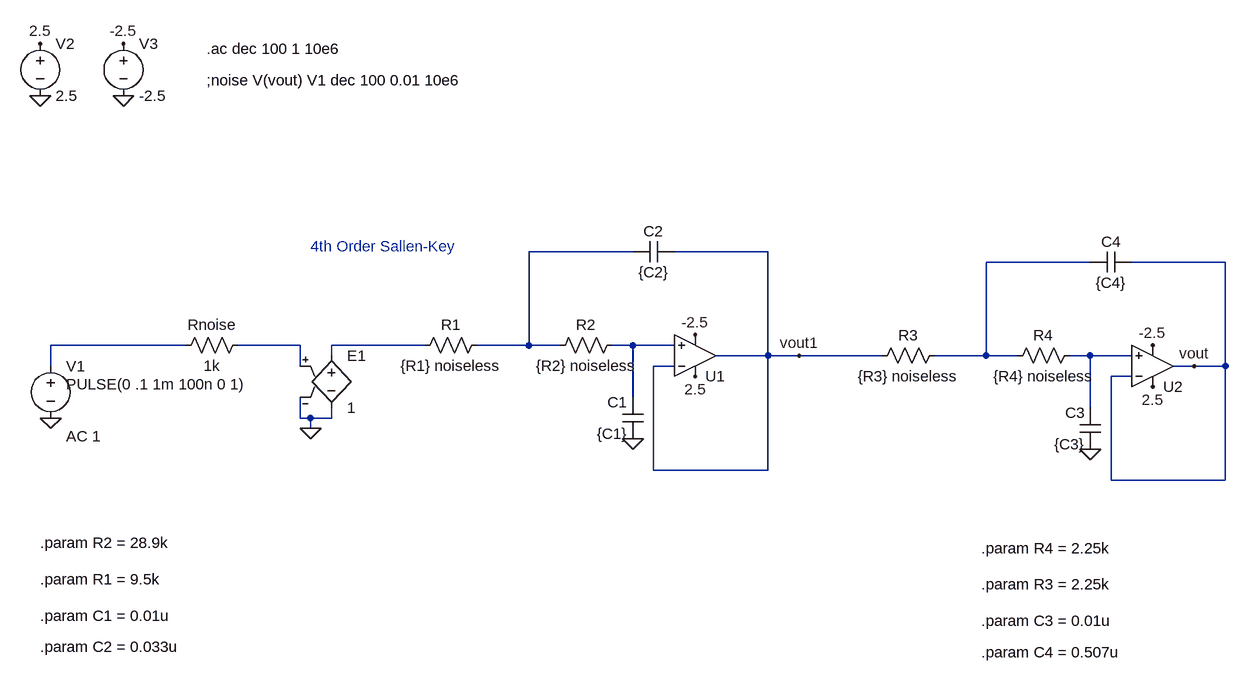
[diagram p0: schematic sallen_key_4th_order.asc]
sallen_key_4th_order.asc, the LTspice schematic file:
Version 4
SHEET 1 1916 856
WIRE 464 0 304 0
WIRE 672 0 528 0
WIRE 1168 16 1008 16
WIRE 1376 16 1232 16
WIRE -224 144 -432 144
WIRE -48 144 -144 144
WIRE 144 144 0 144
WIRE 304 144 304 0
WIRE 304 144 224 144
WIRE 352 144 304 144
WIRE 464 144 432 144
WIRE 528 144 464 144
WIRE 0 160 0 144
WIRE 672 160 672 0
WIRE 672 160 592 160
WIRE 720 160 672 160
WIRE 848 160 720 160
WIRE 1008 160 1008 16
WIRE 1008 160 928 160
WIRE 1056 160 1008 160
WIRE 1168 160 1136 160
WIRE 1232 160 1168 160
WIRE -432 176 -432 144
WIRE -48 176 -48 144
WIRE 528 176 496 176
WIRE 1328 176 1296 176
WIRE 1376 176 1376 16
WIRE 1376 176 1328 176
WIRE 1232 192 1200 192
WIRE 464 224 464 144
WIRE 1168 240 1168 160
WIRE -48 256 -48 224
WIRE -32 256 -48 256
WIRE 0 256 0 240
WIRE 0 256 -32 256
WIRE -32 272 -32 256
WIRE 496 336 496 176
WIRE 672 336 672 160
WIRE 672 336 496 336
WIRE 1200 352 1200 192
WIRE 1376 352 1376 176
WIRE 1376 352 1200 352
FLAG 560 192 2.5
FLAG 560 128 -2.5
FLAG 464 288 0
FLAG -432 256 0
FLAG -448 -320 2.5
FLAG -320 -320 -2.5
FLAG -448 -240 0
FLAG -320 -240 0
FLAG -32 272 0
FLAG 1264 208 2.5
FLAG 1264 144 -2.5
FLAG 1168 304 0
FLAG 1328 176 vout
FLAG 720 160 vout1
SYMBOL Opamps\\UniversalOpamp2 560 160 M180
SYMATTR InstName U1
SYMATTR Value2 Avol=10Meg GBW=10Meg Slew=10Meg
SYMBOL res 448 128 R90
WINDOW 0 0 56 VBottom 2
WINDOW 3 32 56 VTop 2
SYMATTR InstName R2
SYMATTR Value {R2} noiseless
SYMBOL res 240 128 R90
WINDOW 0 0 56 VBottom 2
WINDOW 3 32 56 VTop 2
SYMATTR InstName R1
SYMATTR Value {R1} noiseless
SYMBOL cap 528 -16 R90
WINDOW 0 0 32 VBottom 2
WINDOW 3 32 32 VTop 2
SYMATTR InstName C2
SYMATTR Value {C2}
SYMBOL cap 480 288 R180
WINDOW 0 24 56 Left 2
WINDOW 3 24 8 Left 2
SYMATTR InstName C1
SYMATTR Value {C1}
SYMBOL voltage -432 160 R0
WINDOW 123 24 124 Left 2
WINDOW 39 0 0 Left 0
WINDOW 3 24 44 Left 2
SYMATTR Value2 AC 1
SYMATTR Value PULSE(0 .1 1m 100n 0 1)
SYMATTR InstName V1
SYMBOL voltage -448 -336 R0
WINDOW 123 0 0 Left 0
WINDOW 39 0 0 Left 0
SYMATTR InstName V2
SYMATTR Value 2.5
SYMBOL voltage -320 -336 R0
WINDOW 123 0 0 Left 0
WINDOW 39 0 0 Left 0
SYMATTR InstName V3
SYMATTR Value -2.5
SYMBOL e 0 144 R0
SYMATTR InstName E1
SYMATTR Value 1
SYMBOL res -128 128 R90
WINDOW 0 0 56 VBottom 2
WINDOW 3 32 56 VTop 2
SYMATTR InstName Rnoise
SYMATTR Value 1k
SYMBOL Opamps\\UniversalOpamp2 1264 176 M180
SYMATTR InstName U2
SYMATTR Value2 Avol=10Meg GBW=10Meg Slew=10Meg
SYMBOL res 1152 144 R90
WINDOW 0 0 56 VBottom 2
WINDOW 3 32 56 VTop 2
SYMATTR InstName R4
SYMATTR Value {R4} noiseless
SYMBOL res 944 144 R90
WINDOW 0 0 56 VBottom 2
WINDOW 3 32 56 VTop 2
SYMATTR InstName R3
SYMATTR Value {R3} noiseless
SYMBOL cap 1232 0 R90
WINDOW 0 0 32 VBottom 2
WINDOW 3 32 32 VTop 2
SYMATTR InstName C4
SYMATTR Value {C4}
SYMBOL cap 1184 304 R180
WINDOW 0 24 56 Left 2
WINDOW 3 24 8 Left 2
SYMATTR InstName C3
SYMATTR Value {C3}
TEXT -32 -8 Left 2 ;4th Order Sallen-Key
TEXT -192 -312 Left 2 !.ac dec 100 1 10e6
TEXT -448 448 Left 2 !.param R2 = 28.9k
TEXT -448 560 Left 2 !.param C1 = 0.01u
TEXT -448 608 Left 2 !.param C2 = 0.033u
TEXT -448 504 Left 2 !.param R1 = 9.5k
TEXT -192 -264 Left 2 !;noise V(vout) V1 dec 100 0.01 10e6
TEXT 1000 456 Left 2 !.param R4 = 2.25k
TEXT 1000 568 Left 2 !.param C3 = 0.01u
TEXT 1000 616 Left 2 !.param C4 = 0.507u
TEXT 1000 512 Left 2 !.param R3 = 2.25k

The netlist it stands for:
* sallen_key_4th_order.asc
XU1 N006 vout1 2.5 -2.5 vout1 level.2 Avol=10Meg GBW=10Meg Slew=10Meg ilimit=25m rail=0 Vos=0 phimargin=45 en=0 enk=0 in=0 ink=0 Rin=500Meg  ; pins IN+ IN- V+ V- OUT
R2 N006 N001 {R2} noiseless
R1 N001 N005 {R1} noiseless
C2 vout1 N001 {C2}
C1 0 N006 {C1}
V1 N003 0 PULSE(0 .1 1m 100n 0 1) AC 1
V2 2.5 0 2.5
V3 -2.5 0 -2.5
E1 N005 0 N004 0 1
Rnoise N004 N003 1k
XU2 N007 vout 2.5 -2.5 vout level.2 Avol=10Meg GBW=10Meg Slew=10Meg ilimit=25m rail=0 Vos=0 phimargin=45 en=0 enk=0 in=0 ink=0 Rin=500Meg  ; pins IN+ IN- V+ V- OUT
R4 N007 N002 {R4} noiseless
R3 N002 vout1 {R3} noiseless
C4 vout N002 {C4}
C3 0 N007 {C3}
* 4th Order Sallen-Key
.ac dec 100 1 10e6
.param R2 = 28.9k
.param C1 = 0.01u
.param C2 = 0.033u
.param R1 = 9.5k
;noise V(vout) V1 dec 100 0.01 10e6
.param R4 = 2.25k
.param C3 = 0.01u
.param C4 = 0.507u
.param R3 = 2.25k
.lib UniversalOpamps2.sub
.backanno
.end